# Altium schematic sheet Sheet1.SchDoc
size A; SheetNumber: 1; SheetTotal: 1
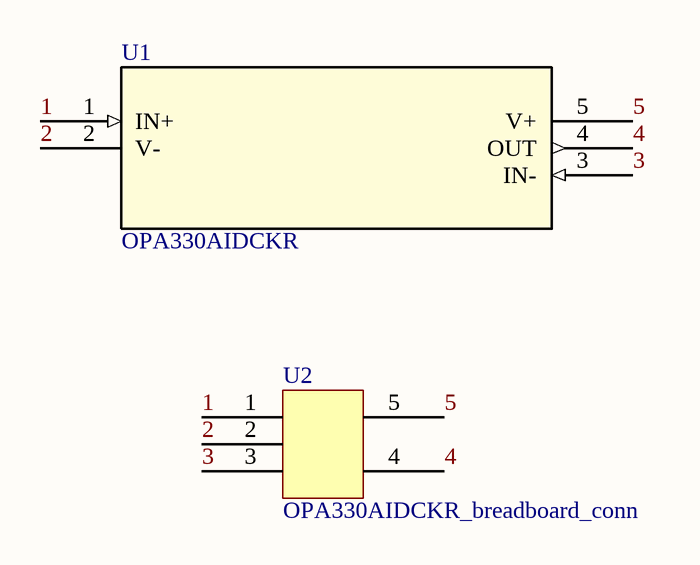
[diagram p0: Sheet1.SchDoc]

## Parts
U1  OPA330AIDCKR  [DCK5]
U2  OPA330AIDCKR_breadboard_conn  [OPA330AIDCKR_breadboard_conn]

## Nets
1: U1.1(IN+) U2.1
2: U1.2(V-) U2.2
3: U1.3(IN-) U2.3
4: U1.4(OUT) U2.4
5: U1.5(V+) U2.5

## Library data of the parts
U1 = OPA330AIDCKR: No Description Available; Mfr_Name: Texas Instruments; RefDes: RefDes; Type: Type